# Altium schematic sheet 19B WLAN_CONNECTOR.SchDoc
size 420 x 297 mm
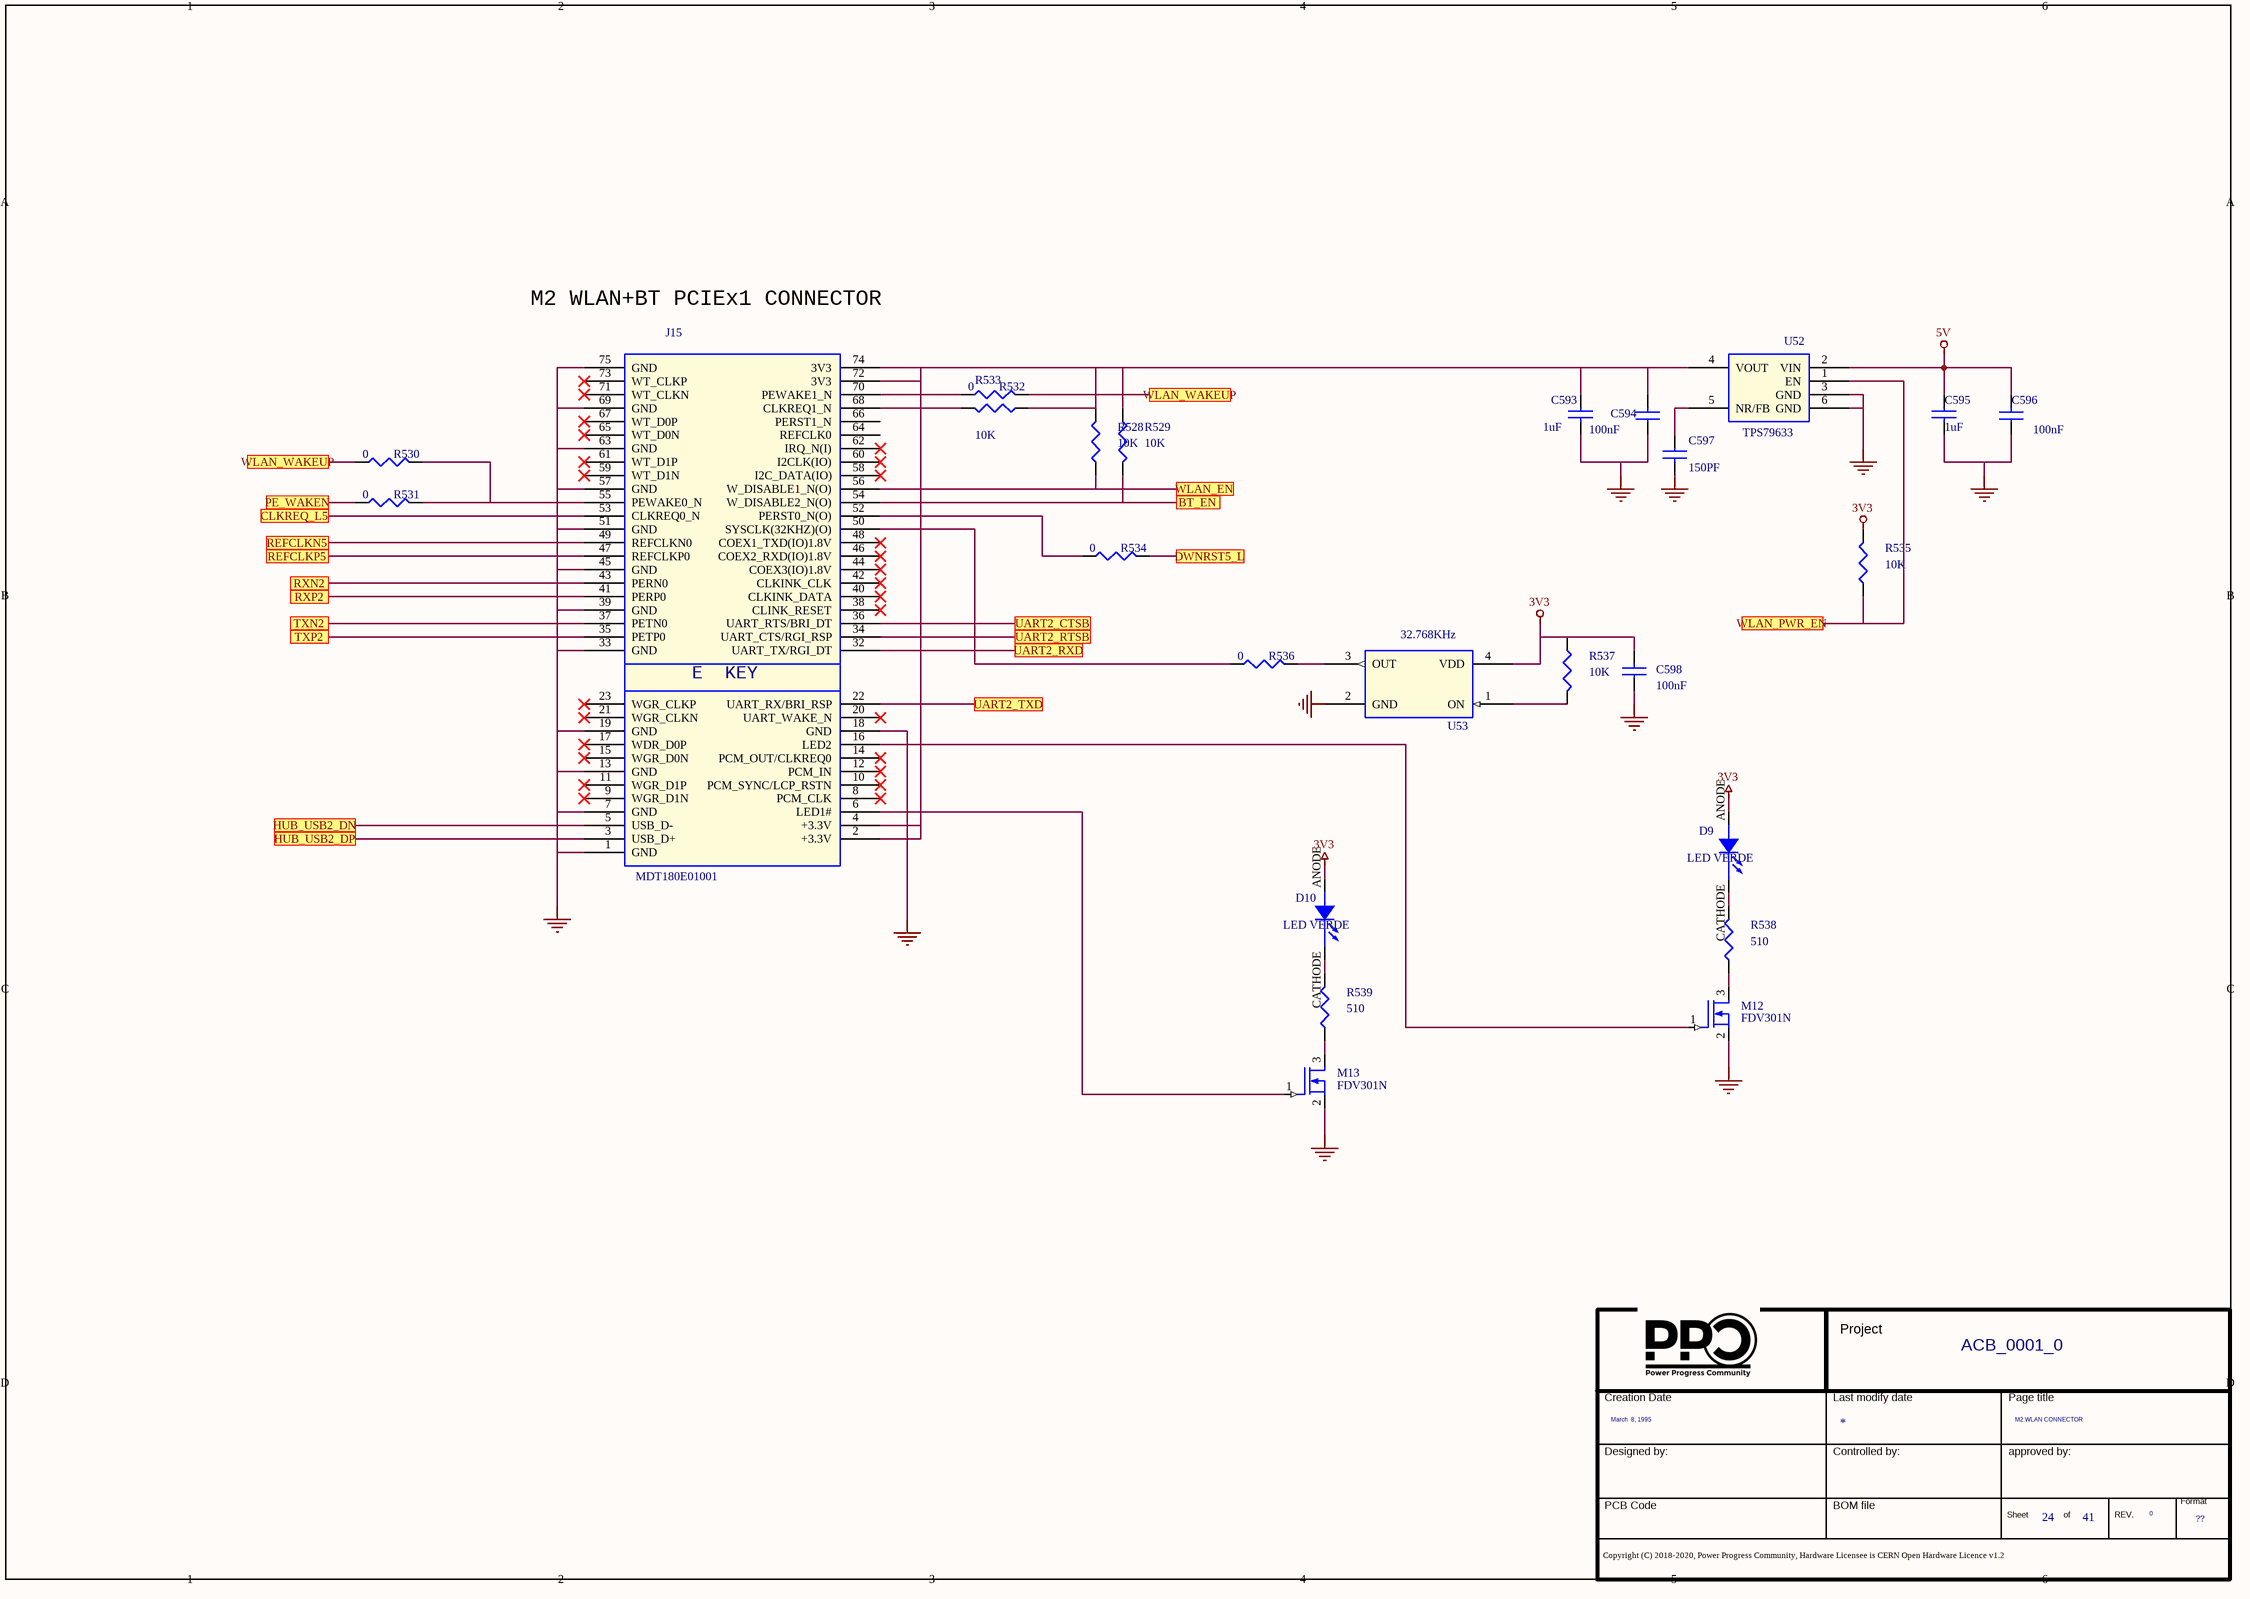
[diagram p0: 19B WLAN_CONNECTOR.SchDoc]

## Parts
*  Page Count: 41  Page Create Date: March  8, 1995  Page Number: 24  Page Size: ??  Page Title: M2.WLAN CONNECTOR  RevCode: 0  Title: ACB_0001_0  (hidden comment: Title_block_PPC)  (graphical)
C593  1uF  [SMD_0402]
C594  100nF  [SMD_0402]
C595  1uF  [SMD_0402]
C596  100nF  [SMD_0402]
C597  150PF  [SMD_0402]
C598  100nF  [SMD_0402]
D9  LED VERDE  [led_0603]
D10  LED VERDE  [led_0603]
J15  MDT180E01001  [67 PIN PASSO 0.5mm]
M12  FDV301N  [sot23]
M13  FDV301N  [sot23]
R528  10K  [SMD_0402]
R529  10K  [SMD_0402]
R530  0  [SMD_0402]
R531  0  [SMD_0402]
R532  0  [SMD_0402]
R533  10K  [SMD_0402]
R534  0  [SMD_0402]
R535  10K  [SMD_0402]
R536  0  [SMD_0402]
R537  10K  [SMD_0402]
R538  510  [SMD_0402]
R539  510  [SMD_0402]
U52  TPS79633  [SOT223-6]
U53  32.768KHz  [4 PIN SMT]

## Ports
BT_EN, CLKREQ_L5, DWNRST5_L, HUB_USB2_DN, HUB_USB2_DP, PE_WAKEN, REFCLKN5, REFCLKP5, RXN2, RXP2, TXN2, TXP2, UART2_CTSB, UART2_RTSB, UART2_RXD, UART2_TXD, WLAN_EN, WLAN_PWR_EN, WLAN_WAKEUP

## Nets
3V3: C598.2 D9.ANODE D10.ANODE R535.1 R537.1 U53.4(VDD)
5V: C595.1 C596.2 U52.2(VIN)
GND: C593.2 C594.1 C595.2 C596.1 C597.2 C598.1 J15.1(GND) J15.7(GND) J15.13(GND) J15.18(GND) J15.19(GND) J15.33(GND) J15.39(GND) J15.45(GND) J15.51(GND) J15.57(GND) J15.63(GND) J15.69(GND) J15.75(GND) M12.2(SOURCE) M13.2(SOURCE) U52.3(GND) U52.6(GND) U53.2(GND)
BT_EN: J15.54(W_DISABLE2_N(O)) R529.2 ; port BT_EN
CLKREQ_L5: J15.53(CLKREQ0_N) ; port CLKREQ_L5
DWNRST5_L: R534.1 ; port DWNRST5_L
HUB_USB2_DN: J15.5(USB_D-) ; port HUB_USB2_DN
HUB_USB2_DP: J15.3(USB_D+) ; port HUB_USB2_DP
PE_WAKEN: R531.2 ; port PE_WAKEN
REFCLKN5: J15.49(REFCLKN0) ; port REFCLKN5
REFCLKP5: J15.47(REFCLKP0) ; port REFCLKP5
RXN2: J15.43(PERN0) ; port RXN2
RXP2: J15.41(PERP0) ; port RXP2
TXN2: J15.37(PETN0) ; port TXN2
TXP2: J15.35(PETP0) ; port TXP2
UART2_CTSB: J15.36(UART_RTS/BRI_DT) ; port UART2_CTSB
UART2_RTSB: J15.34(UART_CTS/RGI_RSP) ; port UART2_RTSB
UART2_RXD: J15.32(UART_TX/RGI_DT) ; port UART2_RXD
UART2_TXD: J15.22(UART_RX/BRI_RSP) ; port UART2_TXD
WLAN_EN: J15.56(W_DISABLE1_N(O)) R528.2 ; port WLAN_EN
WLAN_PWR_EN: R535.2 U52.1(EN) ; port WLAN_PWR_EN
WLAN_WAKEUP: R530.2 R532.1 ; port WLAN_WAKEUP
NetC593_1: C593.1 C594.2 J15.2(+3.3V) J15.4(+3.3V) J15.72(3V3) J15.74(3V3) R528.1 R529.1 R533.2 U52.4(VOUT)
NetC597_1: C597.1 U52.5(NR/FB)
NetD9_CATHODE: D9.CATHODE R538.1
NetD10_CATHODE: D10.CATHODE R539.1
NetJ15_6: J15.6(LED1#) M13.1(GATE)
NetJ15_16: J15.16(LED2) M12.1(GATE)
NetJ15_50: J15.50(SYSCLK(32KHZ)(O)) R536.2
NetJ15_52: J15.52(PERST0_N(O)) R534.2
NetJ15_55: J15.55(PEWAKE0_N) R530.1 R531.1
NetJ15_68: J15.68(CLKREQ1_N) R533.1
NetJ15_70: J15.70(PEWAKE1_N) R532.2
NetM12_3: M12.3(DRAIN) R538.2
NetM13_3: M13.3(DRAIN) R539.2
NetR536_1: R536.1 U53.3(OUT)
NetR537_2: R537.2 U53.1(ON)

Not connected (* = marked no-connect by the designer): J15 8(PCM_CLK)* 9(WGR_D1N)* 10(PCM_SYNC/LCP_RSTN)* 11(WGR_D1P)* 12(PCM_IN)* 14(PCM_OUT/CLKREQ0)* 15(WGR_D0N)* 17(WDR_D0P)* 20(UART_WAKE_N)* 21(WGR_CLKN)* 23(WGR_CLKP)* 38(CLINK_RESET)* 40(CLKINK_DATA)* 42(CLKINK_CLK)* 44(COEX3(IO)1.8V)* 46(COEX2_RXD(IO)1.8V)* 48(COEX1_TXD(IO)1.8V)* 58(I2C_DATA(IO))* 59(WT_D1N)* 60(I2CLK(IO))* 61(WT_D1P)* 62(IRQ_N(I))* 64(REFCLK0) 65(WT_D0N)* 66(PERST1_N) 67(WT_D0P)* 71(WT_CLKN)* 73(WT_CLKP)*

## Notes on the sheet
- M2 WLAN+BT PCIEx1 CONNECTOR
- (in symbol M2_E_KEY) E  KEY
- (in symbol Title_block_PPC) Project; Creation Date; Last modify date; Page title; Designed by:; Controlled by:; approved by:; Format; PCB Code; BOM file; Sheet; of; REV.; Copyright (C) 2018-2020, Power Progress Community, Hardware Licensee is CERN Open Hardware Licence v1.2

## Library data of the parts
* = Title_block_PPC: Schematic Page Count: 45; Schematic Page Number: 27; Page Modify Date: *
C593 = CAP NP_Dup9: CAP CER 1UF 6.3V 10% X5R 0402 AUTOMOTIVE; Part Number: PASSIVE_49; Manufacturer 1: Taiyo Yuden; Manufacturer Part Number 1: JMK105BJ105KVHF; RSM: RC0402; Part Type: Capacitors\Ceramic\SMD\0402; Distributor 1: DIGIKEY (587-3766-1-ND); PCB Footprint: SMD_0402
C594 C598 = CAP NP_Dup9: COND.CER. 100NF 50V 0402 X7R SMD; Manufacturer Part Number 1: CGA2B3X7R1H104M050BD; Manufacturer 1: TDK; Part Number: PASSIVE_24; RSM: RC0402; Distributor 1: MURATA ELETTRONICA SPA; Part Type: Capacitors\Ceramic\SMD\0402; PCB Footprint: SMD_0402
C595 = CAP NP_Dup9: CAP CER 1UF 6.3V 10% X5R 0402 AUTOMOTIVE; Manufacturer Part Number 1: JMK105BJ105KVHF; Manufacturer 1: Taiyo Yuden; Part Number: PASSIVE_49; RSM: RC0402; Distributor 1: DIGIKEY (587-3766-1-ND); Part Type: Capacitors\Ceramic\SMD\0402; PCB Footprint: SMD_0402
C596 = CAP NP_Dup9: COND.CER. 100NF 50V 0402 X7R SMD; Part Number: PASSIVE_24; Manufacturer 1: TDK; Manufacturer Part Number 1: CGA2B3X7R1H104M050BD; RSM: RC0402; Part Type: Capacitors\Ceramic\SMD\0402; Distributor 1: MURATA ELETTRONICA SPA; PCB Footprint: SMD_0402
C597 = CAP NP_Dup9: COND.CER. 150PF 50V 0402 5% COG SMD; Part Number: PASSIVE_39; Manufacturer 1: Murata; Manufacturer Part Number 1: GRM1555C1H151JD01D; RSM: RC0402; Part Type: Capacitors\Ceramic\SMD\0402; Distributor 1: MURATA ELETTRONICA SPA; PCB Footprint: SMD_0402
D9 D10 = LED_1: LED CHIPLED VERDE 40mcd 570nm; Part Number: DISCRETE_31; Manufacturer 1: DIALIGHT; Manufacturer Part Number 1: 598-8070-107F; PCB Footprint: SMD_0603; RSM: LED0603-AK; TYPE: LED; Part Type: Diodes\LED; Distributor 1: MOUSER(645-598-8070-107F)
J15 = M2_E_KEY: Connettori PCI Express/PCI 67P SMT RCPT H1.8 E Key; Part Number: CONNECTORS_680; Manufacturer 1: AMPHENOL; RSM: FCI-MDT180M01001; PCB Footprint: 67 PIN PASSO 0.5mm; Part Type: CON_M2; Manufacturer Part Number 1: MDT180E01001; Distributor 1: MOUSER(523-MDT180E01001)
M12 M13 = NMOS_SOT23: FDV301N N CHANNEL DIGITAL FET; Manufacturer Part Number 1: FDV301N  (ROHS COMPLIANT); Manufacturer 1: FAIRCHILD; Part Number: DISCRETE_196; RSM: SOT-23; Distributor 1: CLAITRON LASI SILVESTAR S.R.L; Part Type: Mosfet\SOT23; PCB Footprint: sot23
R528 R529 R533 R535 R537 = R_Dup5: RESIS.CHIP 10K 1% 0402 SMD; Manufacturer 1: ROYAL OHM; Part Number: PASSIVE_584; RSM: RC0402; Manufacturer Part Number 1: RESIS.CHIP 10K 1% 0402 SMD; PCB Footprint: SMD_0402; Part Type: Resistors\Fixed\SMD\0402\1%
R530 R531 = R_Dup8: RESIS.CHIP 0R 5% 0402 SMD; Part Number: PASSIVE_805; Manufacturer 1: ROYAL OHM; RSM: RC0402; Part Type: Resistors\Fixed\SMD\0402\5%; Manufacturer Part Number 1: RESIS.CHIP 0R 5% 0402 SMD; Distributor 1: CAMEL ELETTRONICA SRL  #; PCB Footprint: SMD_0402
R532 R534 R536 = R_Dup8: RESIS.CHIP 0R 5% 0402 SMD; Manufacturer 1: ROYAL OHM; Part Number: PASSIVE_805; RSM: RC0402; Distributor 1: CAMEL ELETTRONICA SRL  #; Manufacturer Part Number 1: RESIS.CHIP 0R 5% 0402 SMD; Part Type: Resistors\Fixed\SMD\0402\5%; PCB Footprint: SMD_0402
R538 R539 = R_Dup5: RESIS.CHIP 510R 1% 0402 SMD; Manufacturer 1: ROYAL OHM; Part Number: PASSIVE_749; RSM: RC0402; Manufacturer Part Number 1: RESIS.CHIP 510R 1% 0402 SMD; Part Type: Resistors\Fixed\SMD\0402\1%; PCB Footprint: SMD_0402
U52 = TPS79633: IC REG LDO 3.3V 1A SOT223-6; Manufacturer Part Number 1: TPS79633DCQR; Manufacturer 1: TEXAS; Part Number: LINEAR_142; RSM: SOT-223-6; Distributor 1: DIGIKEY(296-13766-1-ND); Part Type: Regulators\LDO; PCB Footprint: SOT223-6
U53 = OSCILLATOR: Oscillator 32.768kHZ 25ppm 1.8V SMD 3225; Manufacturer Part Number 1: TC32M5I32K7680; Manufacturer 1: CTS; Part Number: MISC_92; PCB Footprint: SMD_3.2x2.5; RSM: TSSOP-14; Distributor 1: DIGIKEY(CTX1181CT-ND); Part Type: Oscillator